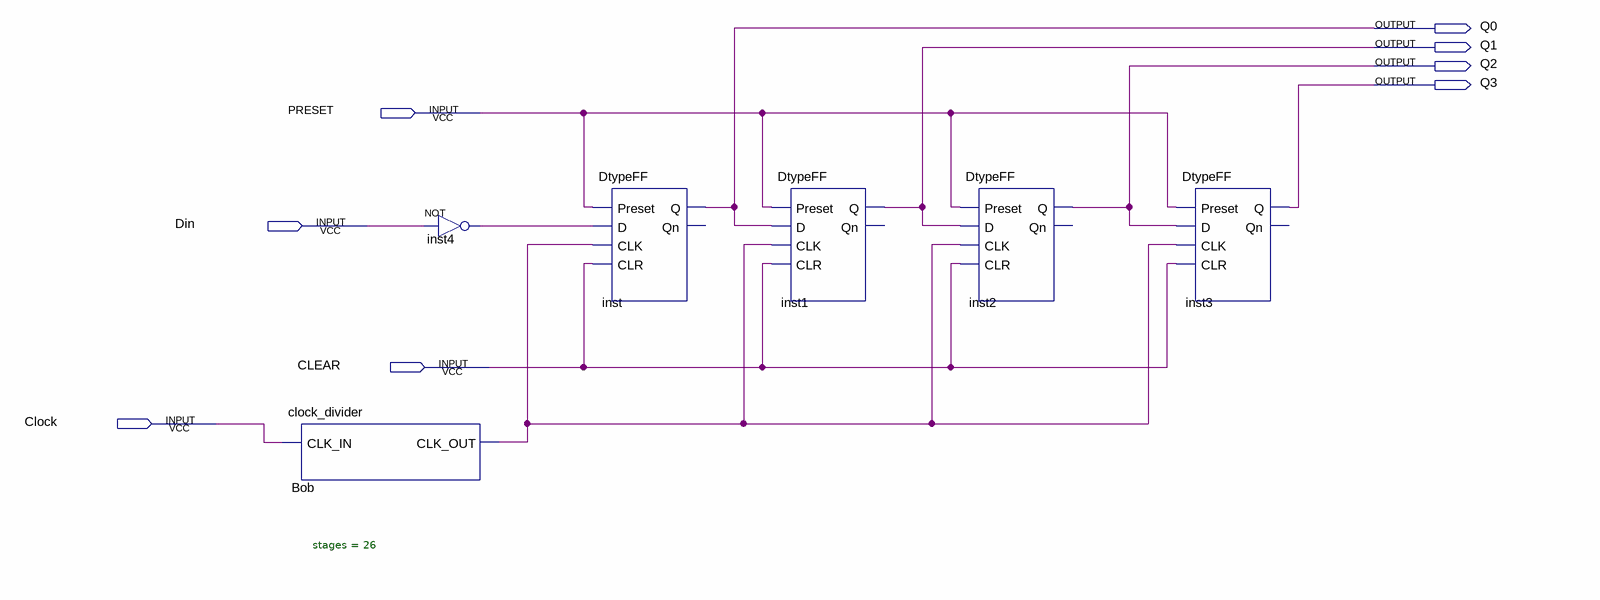
[diagram p0: schematic sheet]
// Quartus schematic srg4_sr.bdf as structural Verilog: 6 symbols, 8 pins
module srg4_sr (
  input  PRESET,
  input  Din,
  input  CLEAR,
  input  Clock,
  output Q0,
  output Q1,
  output Q2,
  output Q3
);

  wire Bob_clk_out, inst4_out;

  clock_divider #(.stages(26)) Bob (.CLK_IN(Clock), .CLK_OUT(Bob_clk_out));
  not inst4 (inst4_out, Din);
  DtypeFF inst (.Preset(PRESET), .D(inst4_out), .CLK(Bob_clk_out), .CLR(CLEAR), .Q(Q0));  // open: Qn
  DtypeFF inst1 (.Preset(PRESET), .D(Q0), .CLK(Bob_clk_out), .CLR(CLEAR), .Q(Q1));  // open: Qn
  DtypeFF inst2 (.Preset(PRESET), .D(Q1), .CLK(Bob_clk_out), .CLR(CLEAR), .Q(Q2));  // open: Qn
  DtypeFF inst3 (.Preset(PRESET), .D(Q2), .CLK(Bob_clk_out), .CLR(CLEAR), .Q(Q3));  // open: Qn
endmodule
